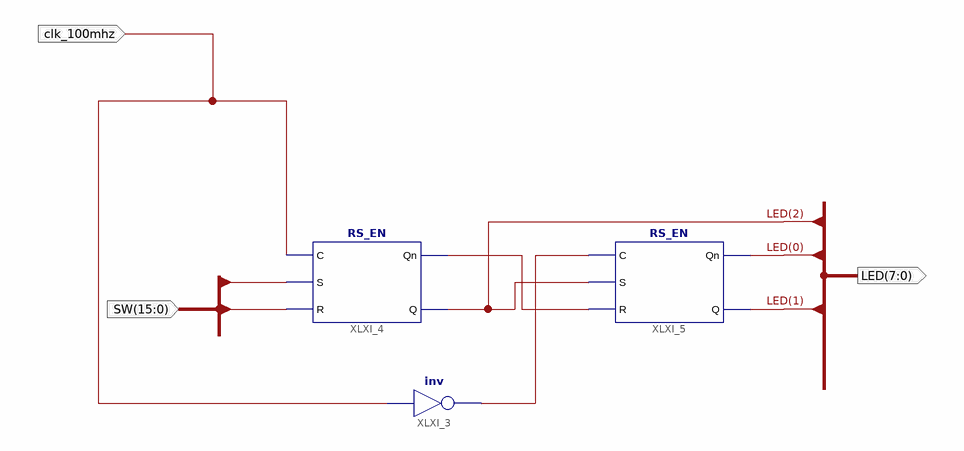
[diagram p0: schematic sheet 1]
// Xilinx ISE schematic RS_Trig.sch (kintex7) as structural Verilog: 3 symbols, 3 ports
module RS_Trig (
  input  clk_100mhz,
  input  [15:0] SW,
  output [7:0] LED
);

  wire XLXN_4, Yn;

  not XLXI_3 (XLXN_4, clk_100mhz);
  RS_EN XLXI_4 (.C(clk_100mhz), .S(SW[0]), .R(SW[1]), .Qn(Yn), .Q(LED[2]));
  RS_EN XLXI_5 (.C(XLXN_4), .S(LED[2]), .R(Yn), .Qn(LED[0]), .Q(LED[1]));
endmodule
